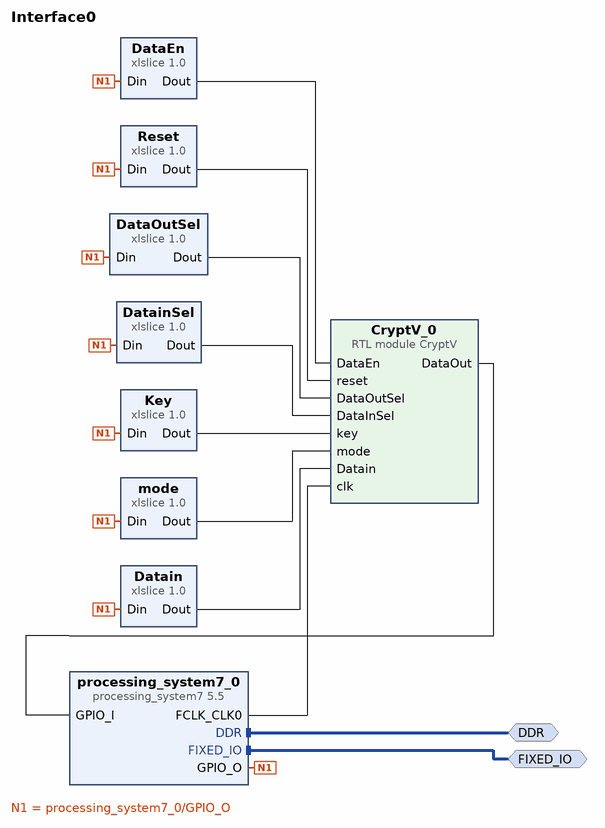
[diagram p0: block diagram of the top level]
# Vivado block design Interface0, xc7z020clg400-1, Vivado 2023.2
create_bd_design Interface0

create_bd_intf_port -mode Master -vlnv xilinx.com:interface:ddrx_rtl:1.0 DDR
create_bd_intf_port -mode Master -vlnv xilinx.com:display_processing_system7:fixedio_rtl:1.0 FIXED_IO

create_bd_cell -type module -reference CryptV CryptV_0
create_bd_cell -type ip -vlnv xilinx.com:ip:processing_system7:5.5 processing_system7_0
set_property -dict [list \
  CONFIG.PCW_APU_PERIPHERAL_FREQMHZ 650 \
  CONFIG.PCW_CRYSTAL_PERIPHERAL_FREQMHZ 50 \
  CONFIG.PCW_ENET0_PERIPHERAL_ENABLE 0 \
  CONFIG.PCW_ENET0_RESET_ENABLE 1 \
  CONFIG.PCW_ENET0_RESET_IO {MIO 9} \
  CONFIG.PCW_ENET_RESET_ENABLE 1 \
  CONFIG.PCW_EN_RST0_PORT 0 \
  CONFIG.PCW_FPGA0_PERIPHERAL_FREQMHZ 100 \
  CONFIG.PCW_FPGA1_PERIPHERAL_FREQMHZ 50 \
  CONFIG.PCW_GPIO_EMIO_GPIO_ENABLE 1 \
  CONFIG.PCW_GPIO_EMIO_GPIO_IO 29 \
  CONFIG.PCW_GPIO_EMIO_GPIO_WIDTH 29 \
  CONFIG.PCW_GPIO_MIO_GPIO_ENABLE 1 \
  CONFIG.PCW_GPIO_MIO_GPIO_IO MIO \
  CONFIG.PCW_I2C_RESET_ENABLE 0 \
  CONFIG.PCW_PERIPHERAL_BOARD_PRESET None \
  CONFIG.PCW_PRESET_BANK1_VOLTAGE {LVCMOS 1.8V} \
  CONFIG.PCW_QSPI_PERIPHERAL_ENABLE 0 \
  CONFIG.PCW_SD0_PERIPHERAL_ENABLE 0 \
  CONFIG.PCW_SDIO_PERIPHERAL_FREQMHZ 50 \
  CONFIG.PCW_UART1_PERIPHERAL_ENABLE 0 \
  CONFIG.PCW_UART_PERIPHERAL_FREQMHZ 100 \
  CONFIG.PCW_UIPARAM_DDR_BUS_WIDTH {16 Bit} \
  CONFIG.PCW_UIPARAM_DDR_FREQ_MHZ 525 \
  CONFIG.PCW_UIPARAM_DDR_PARTNO {MT41J256M16 RE-125} \
  CONFIG.PCW_USB0_PERIPHERAL_ENABLE 0 \
  CONFIG.PCW_USB_RESET_ENABLE 0 \
  CONFIG.PCW_USE_M_AXI_GP0 0 \
] [get_bd_cells processing_system7_0]
# 472 more settings of processing_system7_0 are not shown: defaults, MIO pin electricals, DDR timing, and values the tool derives
create_bd_cell -type ip -vlnv xilinx.com:ip:xlslice:1.0 Datain
set_property -dict {CONFIG.DIN_FROM 7 CONFIG.DIN_WIDTH 29} [get_bd_cells Datain]
create_bd_cell -type ip -vlnv xilinx.com:ip:xlslice:1.0 DataEn
set_property -dict {CONFIG.DIN_FROM 8 CONFIG.DIN_TO 8 CONFIG.DIN_WIDTH 29} [get_bd_cells DataEn]
create_bd_cell -type ip -vlnv xilinx.com:ip:xlslice:1.0 DatainSel
set_property -dict {CONFIG.DIN_FROM 12 CONFIG.DIN_TO 9 CONFIG.DIN_WIDTH 29} [get_bd_cells DatainSel]
create_bd_cell -type ip -vlnv xilinx.com:ip:xlslice:1.0 Key
set_property -dict {CONFIG.DIN_FROM 22 CONFIG.DIN_TO 13 CONFIG.DIN_WIDTH 29} [get_bd_cells Key]
create_bd_cell -type ip -vlnv xilinx.com:ip:xlslice:1.0 mode
set_property -dict {CONFIG.DIN_FROM 23 CONFIG.DIN_TO 23 CONFIG.DIN_WIDTH 29} [get_bd_cells mode]
create_bd_cell -type ip -vlnv xilinx.com:ip:xlslice:1.0 DataOutSel
set_property -dict {CONFIG.DIN_FROM 27 CONFIG.DIN_TO 24 CONFIG.DIN_WIDTH 29} [get_bd_cells DataOutSel]
create_bd_cell -type ip -vlnv xilinx.com:ip:xlslice:1.0 Reset
set_property -dict {CONFIG.DIN_FROM 28 CONFIG.DIN_TO 28 CONFIG.DIN_WIDTH 29} [get_bd_cells Reset]

# ---- connections ----

connect_bd_intf_net [get_bd_intf_ports DDR] [get_bd_intf_pins processing_system7_0/DDR]
connect_bd_intf_net [get_bd_intf_ports FIXED_IO] [get_bd_intf_pins processing_system7_0/FIXED_IO]
connect_bd_net [get_bd_pins CryptV_0/DataOut] [get_bd_pins processing_system7_0/GPIO_I]
connect_bd_net [get_bd_pins DataEn/Dout] [get_bd_pins CryptV_0/DataEn]
connect_bd_net -net DataOutSel1_Dout [get_bd_pins Reset/Dout] [get_bd_pins CryptV_0/reset]
connect_bd_net [get_bd_pins DataOutSel/Dout] [get_bd_pins CryptV_0/DataOutSel]
connect_bd_net -net Datain1_Dout [get_bd_pins DatainSel/Dout] [get_bd_pins CryptV_0/DataInSel]
connect_bd_net -net DatainSel1_Dout [get_bd_pins Key/Dout] [get_bd_pins CryptV_0/key]
connect_bd_net [get_bd_pins mode/Dout] [get_bd_pins CryptV_0/mode]
connect_bd_net [get_bd_pins processing_system7_0/FCLK_CLK0] [get_bd_pins CryptV_0/clk]
connect_bd_net [get_bd_pins processing_system7_0/GPIO_O] \
  [get_bd_pins Datain/Din] [get_bd_pins DataEn/Din] [get_bd_pins DatainSel/Din] [get_bd_pins Key/Din] [get_bd_pins mode/Din] \
  [get_bd_pins DataOutSel/Din] [get_bd_pins Reset/Din]
connect_bd_net -net xlslice_0_Dout [get_bd_pins Datain/Dout] [get_bd_pins CryptV_0/Datain]

validate_bd_design
save_bd_design
